# Altium schematic sheet IC_driver.SchDoc
size A
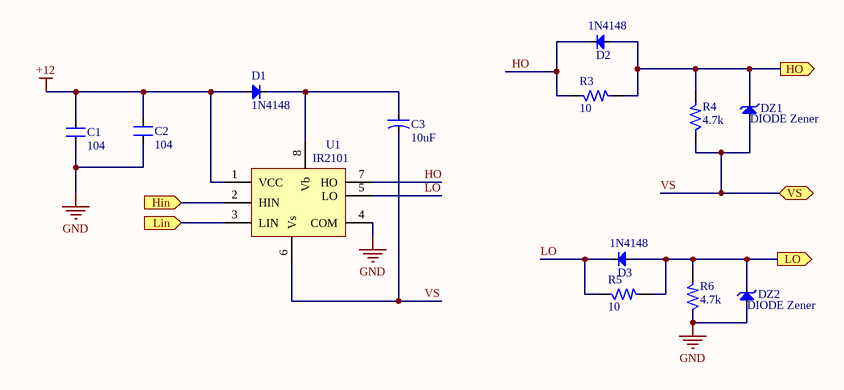
[diagram p0: IC_driver.SchDoc]

## Parts
C1  104  [CAP FILM 0603_1608]
C2  104  [CAP FILM 0603_1608]
C3  10uF  [CAP FILM 0805]
D1  1N4148  [SOD323]
D2  1N4148  [SOD323]
D3  1N4148  [SOD323]
DZ1  DIODE Zener  [DIODES SOT-23-3]
DZ2  DIODE Zener  [DIODES SOT-23-3]
R3  10  [RES 0603_1608]
R4  4.7k  [RES 0603_1608]
R5  10  [RES 0603_1608]
R6  4.7k  [RES 0603_1608]
U1  IR2101  [SO8]

## Ports
Hin (in), HO (out), Lin (in), LO (out), VS (bidir)

## Nets
+12: C1.2 C2.2 D1.1(A) U1.1(VCC)
GND: C1.1 C2.1 DZ2.1(A) R6.1 U1.4(COM)
Hin: U1.2(HIN) ; port Hin
HO: D2.2(K) R3.1 U1.7(HO)
HO: D2.1(A) DZ1.2(K) R3.2 R4.2 ; port HO  [a separate net that carries the same name]
Lin: U1.3(LIN) ; port Lin
LO: D3.2(K) R5.1 U1.5(LO)
LO: D3.1(A) DZ2.2(K) R5.2 R6.2 ; port LO  [a separate net that carries the same name]
VS: C3.2 DZ1.1(A) R4.1 U1.6(Vs) ; port VS
NetC3_1: C3.1 D1.2(K) U1.8(Vb)

## Library data of the parts
C1 C2 = CN: Value: 0,1uF/300V; Designed by: VanDungEvn
C3 = CN-ALU-SMD: Polarized Capacitor (Axial); Published: 8-Jun-2000; LatestRevisionDate: 17-Jul-2002; LatestRevisionNote: Re-released for DXP Platform.; PackageReference: POLAR0.8; Publisher: Altium Limited
D1-D3 = Diode SMD: Default Diode; Code - JEDEC: DO-214-AB; Value: 1N5007; Published: 8-Jun-2000; Revision: July-2002: Re-released for DXP Platform.; Publisher: Altium Limited
DZ1 DZ2 = DIODE Zener: Zenner
R3-R6 = R: Resistor 1/4W; Value: R1/4W - 1K
U1 = IR2101S: Half-Bridge Driver